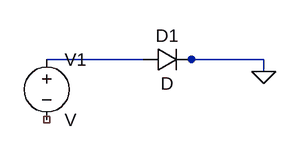
[diagram p0: schematic Draft1.asc]
Draft1.asc, the LTspice schematic file:
Version 4.1
SHEET 1 880 680
WIRE 160 176 32 176
WIRE 224 176 208 176
WIRE 320 176 224 176
WIRE 320 192 320 176
FLAG 320 192 0
SYMBOL diode 160 192 R270
WINDOW 0 32 32 VTop 2
WINDOW 3 0 32 VBottom 2
SYMATTR InstName D1
SYMBOL voltage 32 160 R0
SYMATTR InstName V1

The netlist it stands for:
* Draft1.asc
D1 N001 0 D
V1 N001 NC_01 V
.model D D
.lib standard.dio
.backanno
.end